# Altium schematic sheet curgen797.SchDoc
size A4
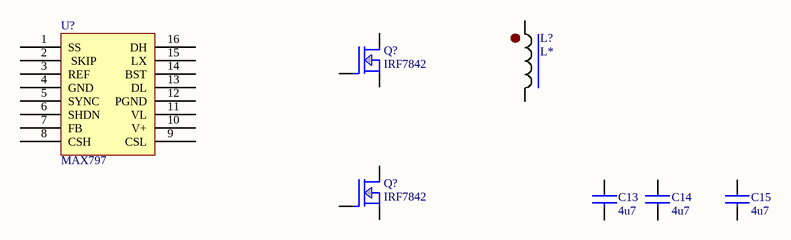
[diagram p0: curgen797.SchDoc]

## Parts
(Parts that share a designator on the sheet are numbered #1, #2 ... from top to bottom, then left to right.)
C13  4u7  [C-1206]
C14  4u7  [C-1206]
C15  4u7  [C-1206]
L?  L*  [SND-0705]
Q?#1  IRF7842  [SO8-(SOT-96-1)]
Q?#2  IRF7842  [SO8-(SOT-96-1)]
U?  MAX797  [SO16-(SOT-109-1)]

## Nets
1: Q?#1.2(SOURCE) Q?#1.3(SOURCE) Q?#2.2(SOURCE) Q?#2.3(SOURCE)
5: Q?#1.6(DRAIN) Q?#1.7(DRAIN) Q?#1.8(DRAIN) Q?#2.6(DRAIN) Q?#2.7(DRAIN) Q?#2.8(DRAIN)

Not connected (* = marked no-connect by the designer): C13 1 2; C14 1 2; C15 1 2; L? 1 2; Q?#1 1(SOURCE) 4(GATE) 5(DRAIN); Q?#2 1(SOURCE) 4(GATE) 5(DRAIN); U? 1(SS) 2(_SKIP) 3(REF) 4(GND) 5(SYNC) 6(SHDN) 7(FB) 8(CSH) 9(CSL) 10(V+) 11(VL) 12(PGND) 13(DL) 14(BST) 15(LX) 16(DH)

## Library data of the parts
C13-C15 = C: Производитель: *; Точность: *; Напряжение: *; Тип диэлектрика: *